# EAGLE schematic PowerBoard (EAGLE 9.6.2)
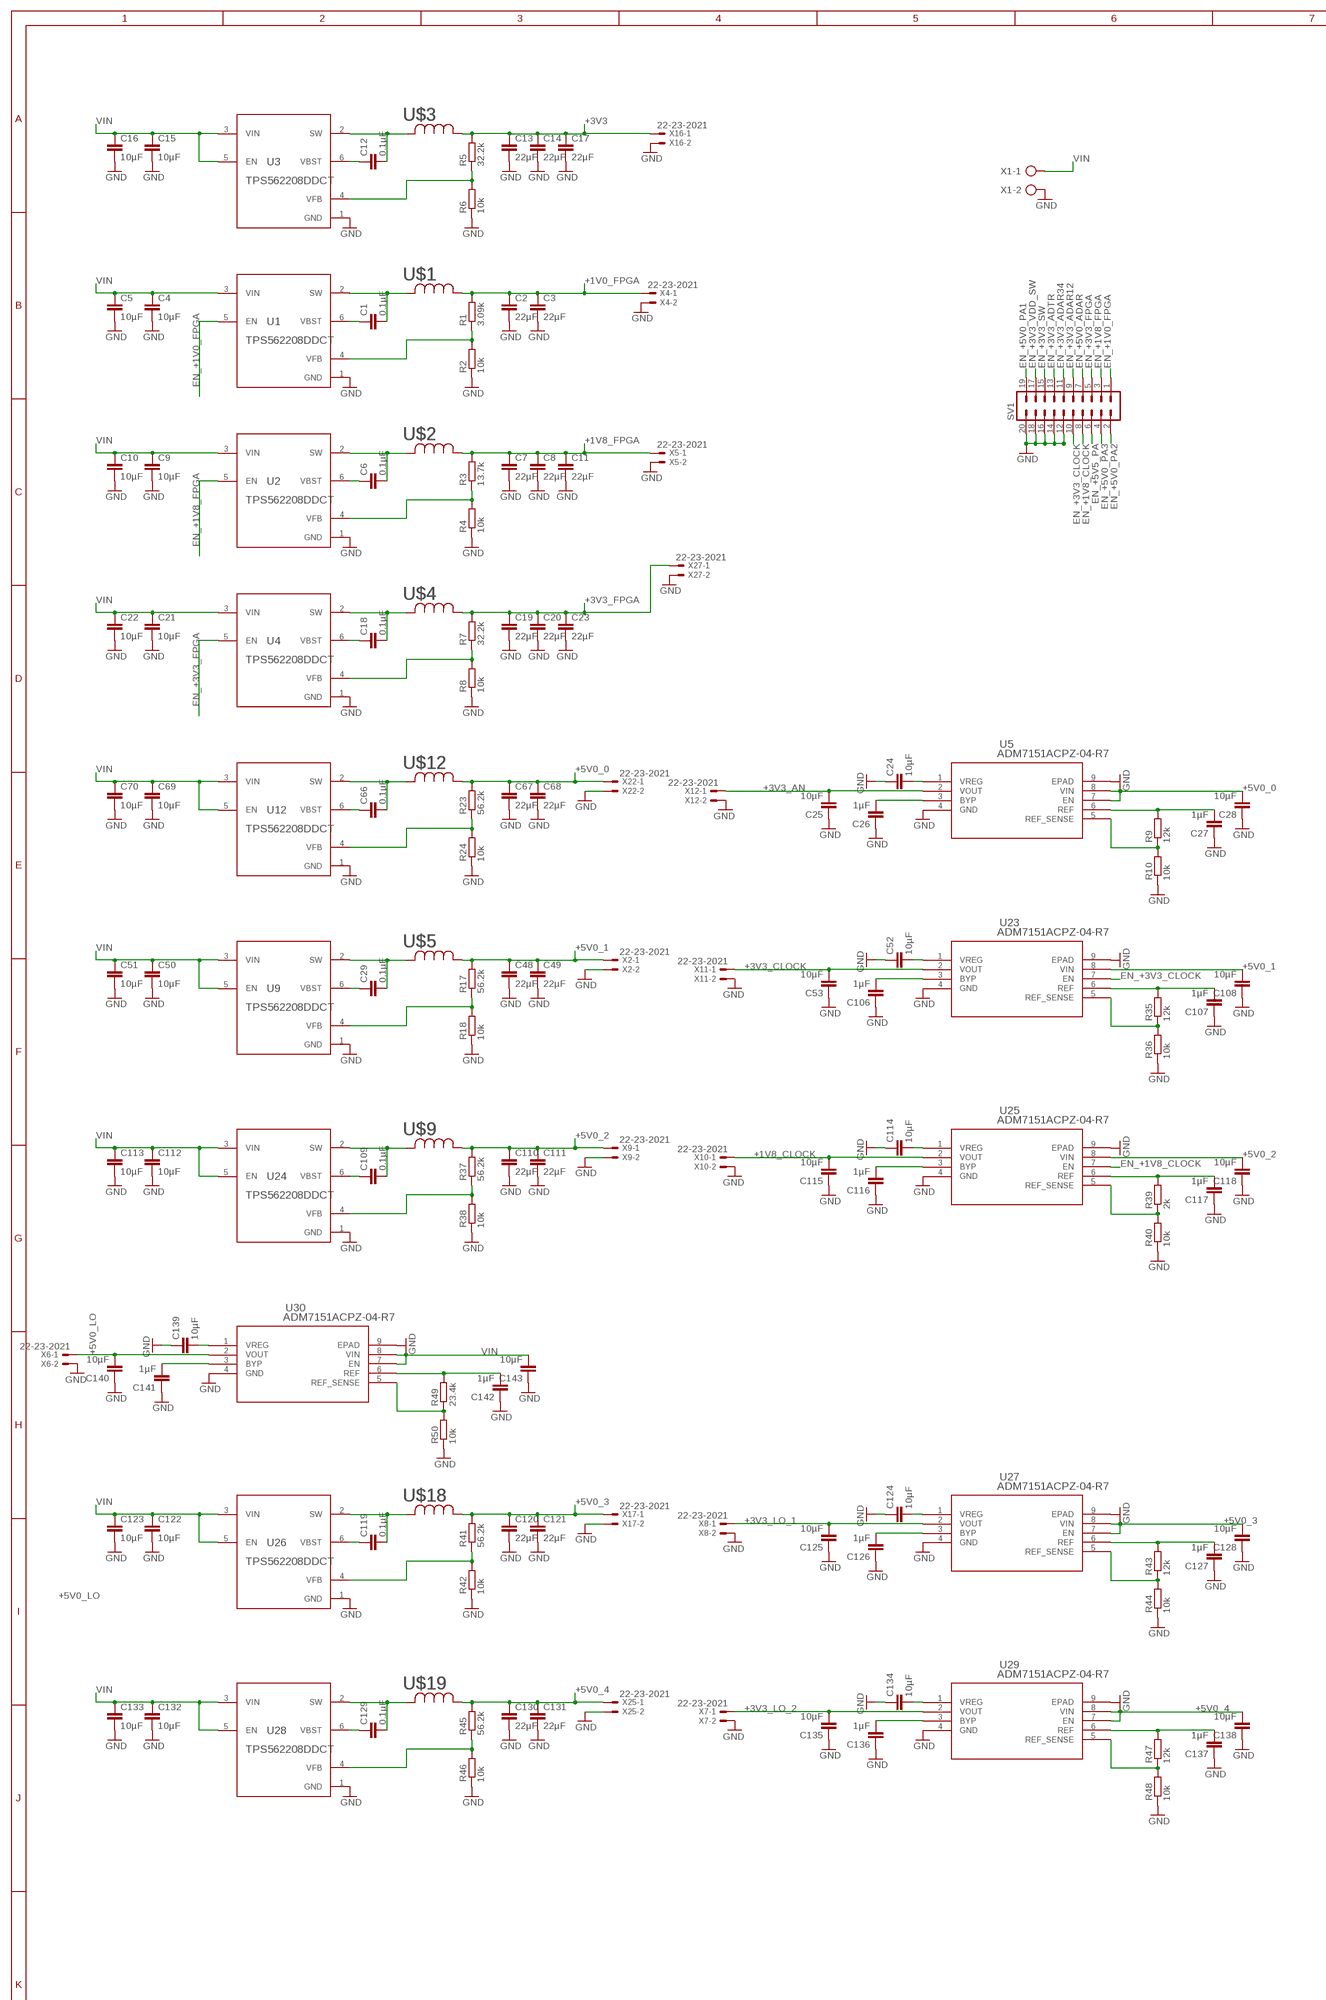
[diagram p0: schematic, sheet 1, part 1 of 3]
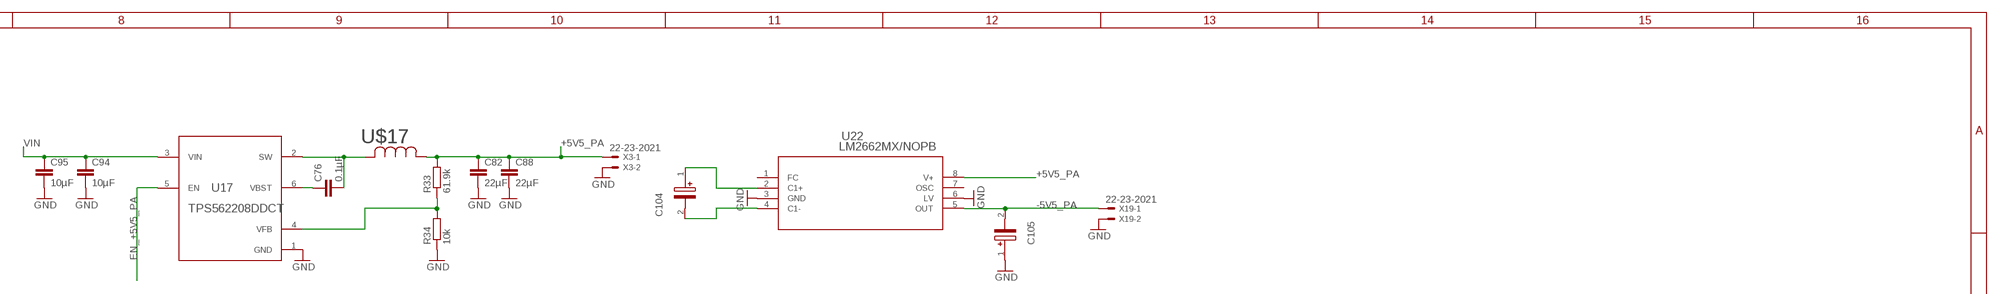
[diagram p1: schematic, sheet 1, part 2 of 3]
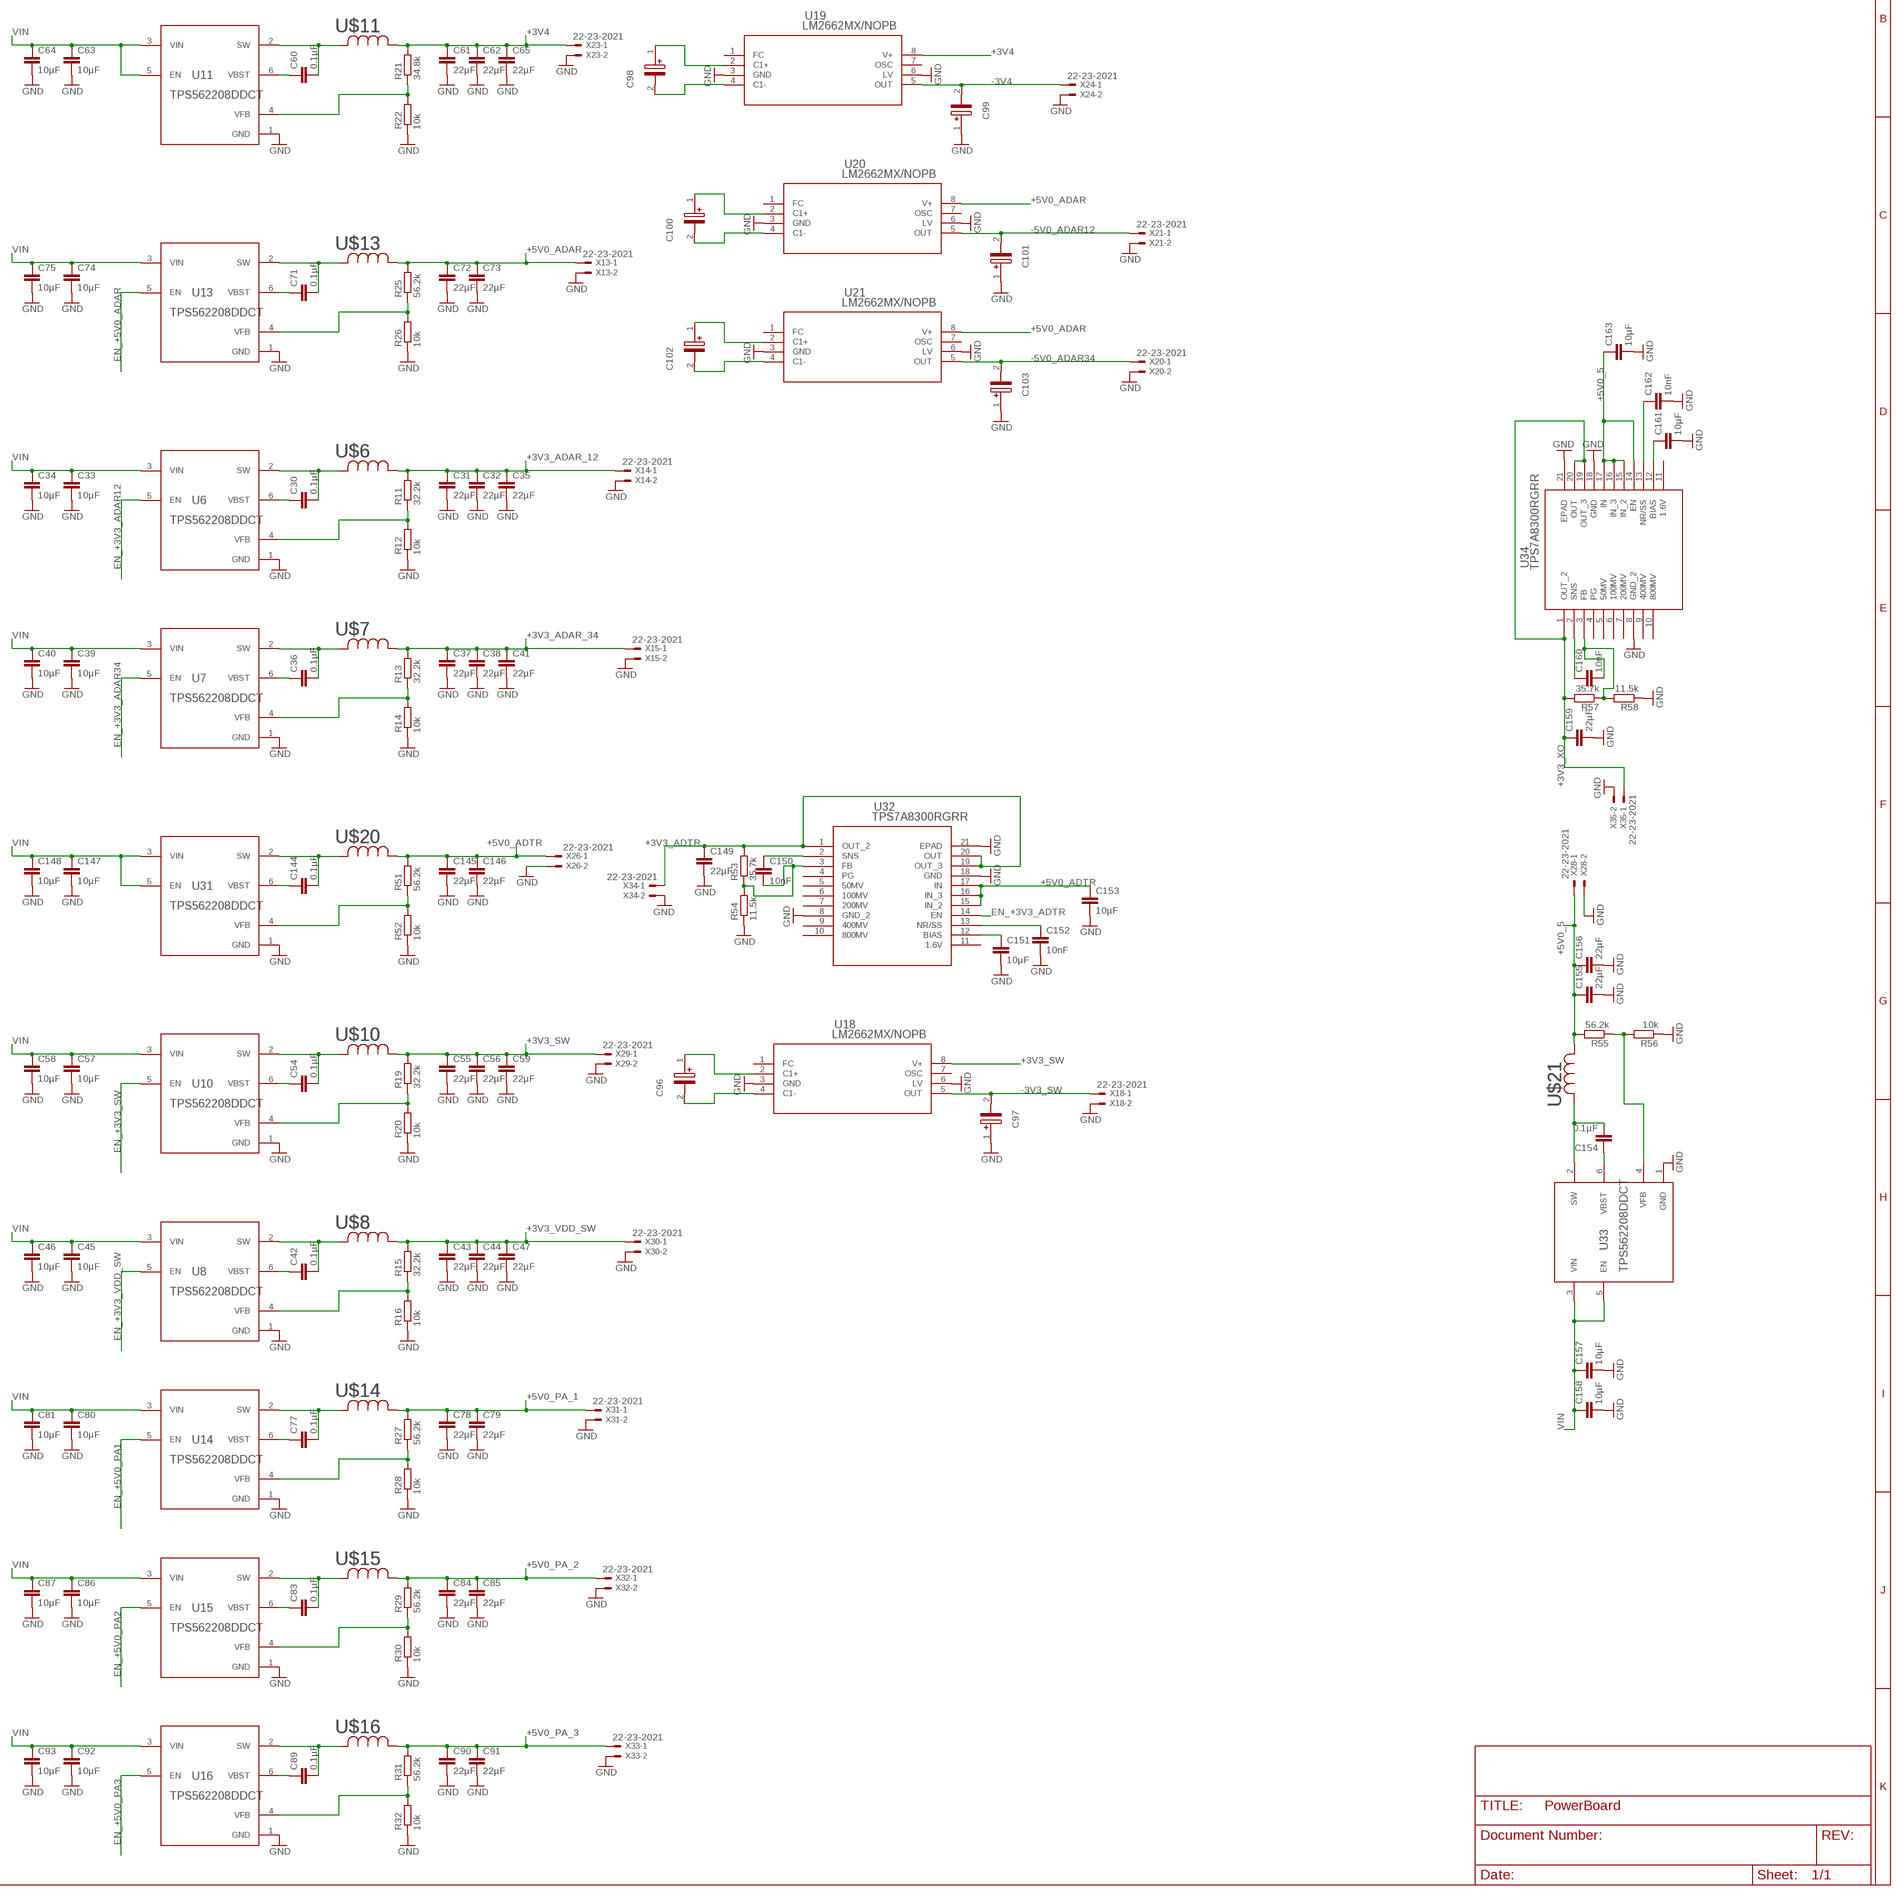
[diagram p2: schematic, sheet 1, part 3 of 3]

## Parts
C1  0.1µF  C-EUC0805  [C0805]
C2  22µF  C-EUC0603  [C0603]
C3  22µF  C-EUC0603  [C0603]
C4  10µF  C-EUC0805  [C0805]
C5  10µF  C-EUC0805  [C0805]
C6  0.1µF  C-EUC0805  [C0805]
C7  22µF  C-EUC0603  [C0603]
C8  22µF  C-EUC0603  [C0603]
C9  10µF  C-EUC0805  [C0805]
C10  10µF  C-EUC0805  [C0805]
C11  22µF  C-EUC0603  [C0603]
C12  0.1µF  C-EUC0805  [C0805]
C13  22µF  C-EUC0603  [C0603]
C14  22µF  C-EUC0603  [C0603]
C15  10µF  C-EUC0805  [C0805]
C16  10µF  C-EUC0805  [C0805]
C17  22µF  C-EUC0603  [C0603]
C18  0.1µF  C-EUC0805  [C0805]
C19  22µF  C-EUC0603  [C0603]
C20  22µF  C-EUC0603  [C0603]
C21  10µF  C-EUC0805  [C0805]
C22  10µF  C-EUC0805  [C0805]
C23  22µF  C-EUC0603  [C0603]
C24  10µF  C-EUC0805  [C0805]
C25  10µF  C-EUC0805  [C0805]
C26  1µF  C-EUC0805  [C0805]
C27  1µF  C-EUC0805  [C0805]
C28  10µF  C-EUC0805  [C0805]
C29  0.1µF  C-EUC0805  [C0805]
C30  0.1µF  C-EUC0805  [C0805]
C31  22µF  C-EUC0603  [C0603]
C32  22µF  C-EUC0603  [C0603]
C33  10µF  C-EUC0805  [C0805]
C34  10µF  C-EUC0805  [C0805]
C35  22µF  C-EUC0603  [C0603]
C36  0.1µF  C-EUC0805  [C0805]
C37  22µF  C-EUC0603  [C0603]
C38  22µF  C-EUC0603  [C0603]
C39  10µF  C-EUC0805  [C0805]
C40  10µF  C-EUC0805  [C0805]
C41  22µF  C-EUC0603  [C0603]
C42  0.1µF  C-EUC0805  [C0805]
C43  22µF  C-EUC0603  [C0603]
C44  22µF  C-EUC0603  [C0603]
C45  10µF  C-EUC0805  [C0805]
C46  10µF  C-EUC0805  [C0805]
C47  22µF  C-EUC0603  [C0603]
C48  22µF  C-EUC0603  [C0603]
C49  22µF  C-EUC0603  [C0603]
C50  10µF  C-EUC0805  [C0805]
C51  10µF  C-EUC0805  [C0805]
C52  10µF  C-EUC0805  [C0805]
C53  10µF  C-EUC0805  [C0805]
C54  0.1µF  C-EUC0805  [C0805]
C55  22µF  C-EUC0603  [C0603]
C56  22µF  C-EUC0603  [C0603]
C57  10µF  C-EUC0805  [C0805]
C58  10µF  C-EUC0805  [C0805]
C59  22µF  C-EUC0603  [C0603]
C60  0.1µF  C-EUC0805  [C0805]
C61  22µF  C-EUC0603  [C0603]
C62  22µF  C-EUC0603  [C0603]
C63  10µF  C-EUC0805  [C0805]
C64  10µF  C-EUC0805  [C0805]
C65  22µF  C-EUC0603  [C0603]
C66  0.1µF  C-EUC0805  [C0805]
C67  22µF  C-EUC0603  [C0603]
C68  22µF  C-EUC0603  [C0603]
C69  10µF  C-EUC0805  [C0805]
C70  10µF  C-EUC0805  [C0805]
C71  0.1µF  C-EUC0805  [C0805]
C72  22µF  C-EUC0603  [C0603]
C73  22µF  C-EUC0603  [C0603]
C74  10µF  C-EUC0805  [C0805]
C75  10µF  C-EUC0805  [C0805]
C76  0.1µF  C-EUC0805  [C0805]
C77  0.1µF  C-EUC0805  [C0805]
C78  22µF  C-EUC0603  [C0603]
C79  22µF  C-EUC0603  [C0603]
C80  10µF  C-EUC0805  [C0805]
C81  10µF  C-EUC0805  [C0805]
C82  22µF  C-EUC0603  [C0603]
C83  0.1µF  C-EUC0805  [C0805]
C84  22µF  C-EUC0603  [C0603]
C85  22µF  C-EUC0603  [C0603]
C86  10µF  C-EUC0805  [C0805]
C87  10µF  C-EUC0805  [C0805]
C88  22µF  C-EUC0603  [C0603]
C89  0.1µF  C-EUC0805  [C0805]
C90  22µF  C-EUC0603  [C0603]
C91  22µF  C-EUC0603  [C0603]
C92  10µF  C-EUC0805  [C0805]
C93  10µF  C-EUC0805  [C0805]
C94  10µF  C-EUC0805  [C0805]
C95  10µF  C-EUC0805  [C0805]
C96  T521W476M020ATE045  [T521W]
C97  T521W476M020ATE045  [T521W]
C98  T521W476M020ATE045  [T521W]
C99  T521W476M020ATE045  [T521W]
C100  T521W476M020ATE045  [T521W]
C101  T521W476M020ATE045  [T521W]
C102  T521W476M020ATE045  [T521W]
C103  T521W476M020ATE045  [T521W]
C104  T521W476M020ATE045  [T521W]
C105  T521W476M020ATE045  [T521W]
C106  1µF  C-EUC0805  [C0805]
C107  1µF  C-EUC0805  [C0805]
C108  10µF  C-EUC0805  [C0805]
C109  0.1µF  C-EUC0805  [C0805]
C110  22µF  C-EUC0603  [C0603]
C111  22µF  C-EUC0603  [C0603]
C112  10µF  C-EUC0805  [C0805]
C113  10µF  C-EUC0805  [C0805]
C114  10µF  C-EUC0805  [C0805]
C115  10µF  C-EUC0805  [C0805]
C116  1µF  C-EUC0805  [C0805]
C117  1µF  C-EUC0805  [C0805]
C118  10µF  C-EUC0805  [C0805]
C119  0.1µF  C-EUC0805  [C0805]
C120  22µF  C-EUC0603  [C0603]
C121  22µF  C-EUC0603  [C0603]
C122  10µF  C-EUC0805  [C0805]
C123  10µF  C-EUC0805  [C0805]
C124  10µF  C-EUC0805  [C0805]
C125  10µF  C-EUC0805  [C0805]
C126  1µF  C-EUC0805  [C0805]
C127  1µF  C-EUC0805  [C0805]
C128  10µF  C-EUC0805  [C0805]
C129  0.1µF  C-EUC0805  [C0805]
C130  22µF  C-EUC0603  [C0603]
C131  22µF  C-EUC0603  [C0603]
C132  10µF  C-EUC0805  [C0805]
C133  10µF  C-EUC0805  [C0805]
C134  10µF  C-EUC0805  [C0805]
C135  10µF  C-EUC0805  [C0805]
C136  1µF  C-EUC0805  [C0805]
C137  1µF  C-EUC0805  [C0805]
C138  10µF  C-EUC0805  [C0805]
C139  10µF  C-EUC0805  [C0805]
C140  10µF  C-EUC0805  [C0805]
C141  1µF  C-EUC0805  [C0805]
C142  1µF  C-EUC0805  [C0805]
C143  10µF  C-EUC0805  [C0805]
C144  0.1µF  C-EUC0805  [C0805]
C145  22µF  C-EUC0603  [C0603]
C146  22µF  C-EUC0603  [C0603]
C147  10µF  C-EUC0805  [C0805]
C148  10µF  C-EUC0805  [C0805]
C149  22µF  C-EUC0603  [C0603]
C150  10nF  C-EUC0603  [C0603]
C151  10µF  C-EUC0603  [C0603]
C152  10nF  C-EUC0603  [C0603]
C153  10µF  C-EUC0603  [C0603]
C154  0.1µF  C-EUC0805  [C0805]
C155  22µF  C-EUC0603  [C0603]
C156  22µF  C-EUC0603  [C0603]
C157  10µF  C-EUC0805  [C0805]
C158  10µF  C-EUC0805  [C0805]
C159  22µF  C-EUC0603  [C0603]
C160  10nF  C-EUC0603  [C0603]
C161  10µF  C-EUC0603  [C0603]
C162  10nF  C-EUC0603  [C0603]
C163  10µF  C-EUC0603  [C0603]
R1  3.09k  R-EU_M0805  [M0805]
R2  10k  R-EU_M0805  [M0805]
R3  13.7k  R-EU_M0805  [M0805]
R4  10k  R-EU_M0805  [M0805]
R5  32.2k  R-EU_M0805  [M0805]
R6  10k  R-EU_M0805  [M0805]
R7  32.2k  R-EU_M0805  [M0805]
R8  10k  R-EU_M0805  [M0805]
R9  12k  R-EU_M0805  [M0805]
R10  10k  R-EU_M0805  [M0805]
R11  32.2k  R-EU_M0805  [M0805]
R12  10k  R-EU_M0805  [M0805]
R13  32.2k  R-EU_M0805  [M0805]
R14  10k  R-EU_M0805  [M0805]
R15  32.2k  R-EU_M0805  [M0805]
R16  10k  R-EU_M0805  [M0805]
R17  56.2k  R-EU_M0805  [M0805]
R18  10k  R-EU_M0805  [M0805]
R19  32.2k  R-EU_M0805  [M0805]
R20  10k  R-EU_M0805  [M0805]
R21  34.8k  R-EU_M0805  [M0805]
R22  10k  R-EU_M0805  [M0805]
R23  56.2k  R-EU_M0805  [M0805]
R24  10k  R-EU_M0805  [M0805]
R25  56.2k  R-EU_M0805  [M0805]
R26  10k  R-EU_M0805  [M0805]
R27  56.2k  R-EU_M0805  [M0805]
R28  10k  R-EU_M0805  [M0805]
R29  56.2k  R-EU_M0805  [M0805]
R30  10k  R-EU_M0805  [M0805]
R31  56.2k  R-EU_M0805  [M0805]
R32  10k  R-EU_M0805  [M0805]
R33  61.9k  R-EU_M0805  [M0805]
R34  10k  R-EU_M0805  [M0805]
R35  12k  R-EU_M0805  [M0805]
R36  10k  R-EU_M0805  [M0805]
R37  56.2k  R-EU_M0805  [M0805]
R38  10k  R-EU_M0805  [M0805]
R39  2k  R-EU_M0805  [M0805]
R40  10k  R-EU_M0805  [M0805]
R41  56.2k  R-EU_M0805  [M0805]
R42  10k  R-EU_M0805  [M0805]
R43  12k  R-EU_M0805  [M0805]
R44  10k  R-EU_M0805  [M0805]
R45  56.2k  R-EU_M0805  [M0805]
R46  10k  R-EU_M0805  [M0805]
R47  12k  R-EU_M0805  [M0805]
R48  10k  R-EU_M0805  [M0805]
R49  23.4k  R-EU_M0805  [M0805]
R50  10k  R-EU_M0805  [M0805]
R51  56.2k  R-EU_M0805  [M0805]
R52  10k  R-EU_M0805  [M0805]
R53  35.7k  R-EU_M0805  [M0805]
R54  11.5k  R-EU_M0805  [M0805]
R55  56.2k  R-EU_M0805  [M0805]
R56  10k  R-EU_M0805  [M0805]
R57  35.7k  R-EU_M0805  [M0805]
R58  11.5k  R-EU_M0805  [M0805]
SV1  MA10-2  [MA10-2]
U1  TPS562208DDCT  [DDC0006A_N]
U2  TPS562208DDCT  [DDC0006A_N]
U3  TPS562208DDCT  [DDC0006A_N]
U4  TPS562208DDCT  [DDC0006A_N]
U5  ADM7151ACPZ-04-R7  [CP_8_11_ADI]
U6  TPS562208DDCT  [DDC0006A_N]
U7  TPS562208DDCT  [DDC0006A_N]
U8  TPS562208DDCT  [DDC0006A_N]
U9  TPS562208DDCT  [DDC0006A_N]
U10  TPS562208DDCT  [DDC0006A_N]
U11  TPS562208DDCT  [DDC0006A_N]
U12  TPS562208DDCT  [DDC0006A_N]
U13  TPS562208DDCT  [DDC0006A_N]
U14  TPS562208DDCT  [DDC0006A_N]
U15  TPS562208DDCT  [DDC0006A_N]
U16  TPS562208DDCT  [DDC0006A_N]
U17  TPS562208DDCT  [DDC0006A_N]
U18  LM2662MX/NOPB  [M08A]
U19  LM2662MX/NOPB  [M08A]
U20  LM2662MX/NOPB  [M08A]
U21  LM2662MX/NOPB  [M08A]
U22  LM2662MX/NOPB  [M08A]
U23  ADM7151ACPZ-04-R7  [CP_8_11_ADI]
U24  TPS562208DDCT  [DDC0006A_N]
U25  ADM7151ACPZ-04-R7  [CP_8_11_ADI]
U26  TPS562208DDCT  [DDC0006A_N]
U27  ADM7151ACPZ-04-R7  [CP_8_11_ADI]
U28  TPS562208DDCT  [DDC0006A_N]
U29  ADM7151ACPZ-04-R7  [CP_8_11_ADI]
U30  ADM7151ACPZ-04-R7  [CP_8_11_ADI]
U31  TPS562208DDCT  [DDC0006A_N]
U32  TPS7A8300RGRR  [RGR20_2P05X2P05_TEX]
U33  TPS562208DDCT  [DDC0006A_N]
U34  TPS7A8300RGRR  [RGR20_2P05X2P05_TEX]
U$1  2.2µH  POWER_INDUCTOR  [IND_VLP8040T-1R0N_TDK]
U$2  2.2µH  POWER_INDUCTOR  [IND_VLP8040T-1R0N_TDK]
U$3  3.3µH  POWER_INDUCTOR  [IND_VLP8040T-1R0N_TDK]
U$4  3.3µH  POWER_INDUCTOR  [IND_VLP8040T-1R0N_TDK]
U$5  3.3µH  POWER_INDUCTOR  [IND_VLP8040T-1R0N_TDK]
U$6  3.3µH  POWER_INDUCTOR  [IND_VLP8040T-1R0N_TDK]
U$7  3.3µH  POWER_INDUCTOR  [IND_VLP8040T-1R0N_TDK]
U$8  3.3µH  POWER_INDUCTOR  [IND_VLP8040T-1R0N_TDK]
U$9  3.3µH  POWER_INDUCTOR  [IND_VLP8040T-1R0N_TDK]
U$10  3.3µH  POWER_INDUCTOR  [IND_VLP8040T-1R0N_TDK]
U$11  3.3µH  POWER_INDUCTOR  [IND_VLP8040T-1R0N_TDK]
U$12  3.3µH  POWER_INDUCTOR  [IND_VLP8040T-1R0N_TDK]
U$13  3.3µH  POWER_INDUCTOR  [IND_VLP8040T-1R0N_TDK]
U$14  3.3µH  POWER_INDUCTOR  [IND_VLP8040T-1R0N_TDK]
U$15  3.3µH  POWER_INDUCTOR  [IND_VLP8040T-1R0N_TDK]
U$16  3.3µH  POWER_INDUCTOR  [IND_VLP8040T-1R0N_TDK]
U$17  3.3µH  POWER_INDUCTOR  [IND_VLP8040T-1R0N_TDK]
U$18  3.3µH  POWER_INDUCTOR  [IND_VLP8040T-1R0N_TDK]
U$19  3.3µH  POWER_INDUCTOR  [IND_VLP8040T-1R0N_TDK]
U$20  3.3µH  POWER_INDUCTOR  [IND_VLP8040T-1R0N_TDK]
U$21  3.3µH  POWER_INDUCTOR  [IND_VLP8040T-1R0N_TDK]
X1  AK300/2  [AK300/2]
X2  22-23-2021  [22-23-2021]
X3  22-23-2021  [22-23-2021]
X4  22-23-2021  [22-23-2021]
X5  22-23-2021  [22-23-2021]
X6  22-23-2021  [22-23-2021]
X7  22-23-2021  [22-23-2021]
X8  22-23-2021  [22-23-2021]
X9  22-23-2021  [22-23-2021]
X10  22-23-2021  [22-23-2021]
X11  22-23-2021  [22-23-2021]
X12  22-23-2021  [22-23-2021]
X13  22-23-2021  [22-23-2021]
X14  22-23-2021  [22-23-2021]
X15  22-23-2021  [22-23-2021]
X16  22-23-2021  [22-23-2021]
X17  22-23-2021  [22-23-2021]
X18  22-23-2021  [22-23-2021]
X19  22-23-2021  [22-23-2021]
X20  22-23-2021  [22-23-2021]
X21  22-23-2021  [22-23-2021]
X22  22-23-2021  [22-23-2021]
X23  22-23-2021  [22-23-2021]
X24  22-23-2021  [22-23-2021]
X25  22-23-2021  [22-23-2021]
X26  22-23-2021  [22-23-2021]
X27  22-23-2021  [22-23-2021]
X28  22-23-2021  [22-23-2021]
X29  22-23-2021  [22-23-2021]
X30  22-23-2021  [22-23-2021]
X31  22-23-2021  [22-23-2021]
X32  22-23-2021  [22-23-2021]
X33  22-23-2021  [22-23-2021]
X34  22-23-2021  [22-23-2021]
X35  22-23-2021  [22-23-2021]

## Nets
+1V0_FPGA: C2.1 C3.1 R1.2 U$1.1 X4.1
+1V8_CLOCK: C115.2 U25.2(VOUT) X10.1
+1V8_FPGA: C7.1 C8.1 C11.1 R3.2 U$2.1 X5.1
+3V3: C13.1 C14.1 C17.1 R5.2 U$3.1 X16.1
+3V3_ADAR_12: C31.1 C32.1 C35.1 R11.2 U$6.1 X14.1
+3V3_ADAR_34: C37.1 C38.1 C41.1 R13.2 U$7.1 X15.1
+3V3_ADTR: C149.1 R53.2 U32.1(OUT_2) U32.19(OUT_3) U32.20(OUT) X34.1
+3V3_AN: C25.2 U5.2(VOUT) X12.1
+3V3_CLOCK: C53.2 U23.2(VOUT) X11.1
+3V3_FPGA: C19.1 C20.1 C23.1 R7.2 U$4.1 X27.1
+3V3_LO_1: C125.2 U27.2(VOUT) X8.1
+3V3_LO_2: C135.2 U29.2(VOUT) X7.1
+3V3_SW: C55.1 C56.1 C59.1 R19.2 U18.8(V+) U$10.1 X29.1
+3V3_VDD_SW: C43.1 C44.1 C47.1 R15.2 U$8.1 X30.1
+3V3_XO: C159.1 R57.2 U34.1(OUT_2) U34.19(OUT_3) U34.20(OUT) X35.1
+3V4: C61.1 C62.1 C65.1 R21.2 U19.8(V+) U$11.1 X23.1
+5V0_0: C28.2 C67.1 C68.1 R23.2 U5.7(EN) U5.8(VIN) U$12.1 X22.1
+5V0_1: C48.1 C49.1 C108.2 R17.2 U23.8(VIN) U$5.1 X2.1
+5V0_2: C110.1 C111.1 C118.2 R37.2 U25.8(VIN) U$9.1 X9.1
+5V0_3: C120.1 C121.1 C128.2 R41.2 U27.7(EN) U27.8(VIN) U$18.1 X17.1
+5V0_4: C130.1 C131.1 C138.2 R45.2 U29.7(EN) U29.8(VIN) U$19.1 X25.1
+5V0_5: C155.1 C156.1 C163.1 R55.2 U34.14(EN) U34.15(IN_2) U34.16(IN_3) U34.17(IN) U$21.1 X28.1
+5V0_ADAR: C72.1 C73.1 R25.2 U20.8(V+) U21.8(V+) U$13.1 X13.1
+5V0_ADTR: C145.1 C146.1 C153.1 R51.2 U32.15(IN_2) U32.16(IN_3) U32.17(IN) U$20.1 X26.1
+5V0_LO: C140.2 U30.2(VOUT) X6.1
+5V0_PA_1: C78.1 C79.1 R27.2 U$14.1 X31.1
+5V0_PA_2: C84.1 C85.1 R29.2 U$15.1 X32.1
+5V0_PA_3: C90.1 C91.1 R31.2 U$16.1 X33.1
+5V5_PA: C82.1 C88.1 R33.2 U22.8(V+) U$17.1 X3.1
-3V3_SW: C97.2(-) U18.5(OUT) X18.1
-3V4: C99.2(-) U19.5(OUT) X24.1
-5V0_ADAR12: C101.2(-) U20.5(OUT) X21.1
-5V0_ADAR34: C103.2(-) U21.5(OUT) X20.1
-5V5_PA: C105.2(-) U22.5(OUT) X19.1
EN_+1V0_FPGA: SV1.1 U1.5(EN)
EN_+1V8_CLOCK: SV1.8 U25.7(EN)
EN_+1V8_FPGA: SV1.3 U2.5(EN)
EN_+3V3_ADAR12: SV1.9 U6.5(EN)
EN_+3V3_ADAR34: SV1.11 U7.5(EN)
EN_+3V3_ADTR: SV1.13 U32.14(EN)
EN_+3V3_CLOCK: SV1.10 U23.7(EN)
EN_+3V3_FPGA: SV1.5 U4.5(EN)
EN_+3V3_SW: SV1.15 U10.5(EN)
EN_+3V3_VDD_SW: SV1.17 U8.5(EN)
EN_+5V0_ADAR: SV1.7 U13.5(EN)
EN_+5V0_PA1: SV1.19 U14.5(EN)
EN_+5V0_PA2: SV1.2 U15.5(EN)
EN_+5V0_PA3: SV1.4 U16.5(EN)
EN_+5V5_PA: SV1.6 U17.5(EN)
GND: C2.2 C3.2 C4.2 C5.2 C7.2 C8.2 C9.2 C10.2 C11.2 C13.2 C14.2 C15.2 C16.2 C17.2 C19.2 C20.2 C21.2 C22.2 C23.2 C24.1 C25.1 C26.1 C27.1 C28.1 C31.2 C32.2 C33.2 C34.2 C35.2 C37.2 C38.2 C39.2 C40.2 C41.2 C43.2 C44.2 C45.2 C46.2 C47.2 C48.2 C49.2 C50.2 C51.2 C52.1 C53.1 C55.2 C56.2 C57.2 C58.2 C59.2 C61.2 C62.2 C63.2 C64.2 C65.2 C67.2 C68.2 C69.2 C70.2 C72.2 C73.2 C74.2 C75.2 C78.2 C79.2 C80.2 C81.2 C82.2 C84.2 C85.2 C86.2 C87.2 C88.2 C90.2 C91.2 C92.2 C93.2 C94.2 C95.2 C97.1(+) C99.1(+) C101.1(+) C103.1(+) C105.1(+) C106.1 C107.1 C108.1 C110.2 C111.2 C112.2 C113.2 C114.1 C115.1 C116.1 C117.1 C118.1 C120.2 C121.2 C122.2 C123.2 C124.1 C125.1 C126.1 C127.1 C128.1 C130.2 C131.2 C132.2 C133.2 C134.1 C135.1 C136.1 C137.1 C138.1 C139.1 C140.1 C141.1 C142.1 C143.1 C145.2 C146.2 C147.2 C148.2 C149.2 C151.2 C152.2 C153.2 C155.2 C156.2 C157.2 C158.2 C159.2 C161.2 C162.2 C163.2 R2.1 R4.1 R6.1 R8.1 R10.1 R12.1 R14.1 R16.1 R18.1 R20.1 R22.1 R24.1 R26.1 R28.1 R30.1 R32.1 R34.1 R36.1 R38.1 R40.1 R42.1 R44.1 R46.1 R48.1 R50.1 R52.1 R54.1 R56.1 R58.1 SV1.12 SV1.14 SV1.16 SV1.18 SV1.20 U1.1(GND) U2.1(GND) U3.1(GND) U4.1(GND) U5.4(GND) U5.9(EPAD) U6.1(GND) U7.1(GND) U8.1(GND) U9.1(GND) U10.1(GND) U11.1(GND) U12.1(GND) U13.1(GND) U14.1(GND) U15.1(GND) U16.1(GND) U17.1(GND) U18.3(GND) U18.6(LV) U19.3(GND) U19.6(LV) U20.3(GND) U20.6(LV) U21.3(GND) U21.6(LV) U22.3(GND) U22.6(LV) U23.4(GND) U23.9(EPAD) U24.1(GND) U25.4(GND) U25.9(EPAD) U26.1(GND) U27.4(GND) U27.9(EPAD) U28.1(GND) U29.4(GND) U29.9(EPAD) U30.4(GND) U30.9(EPAD) U31.1(GND) U32.8(GND_2) U32.18(GND) U32.21(EPAD) U33.1(GND) U34.8(GND_2) U34.18(GND) U34.21(EPAD) X1.2 X2.2 X3.2 X4.2 X5.2 X6.2 X7.2 X8.2 X9.2 X10.2 X11.2 X12.2 X13.2 X14.2 X15.2 X16.2 X17.2 X18.2 X19.2 X20.2 X21.2 X22.2 X23.2 X24.2 X25.2 X26.2 X27.2 X28.2 X29.2 X30.2 X31.2 X32.2 X33.2 X34.2 X35.2
N$1: C1.2 U1.2(SW) U$1.2
N$2: C1.1 U1.6(VBST)
N$3: C6.2 U2.2(SW) U$2.2
N$4: R1.1 R2.2 U1.4(VFB)
N$5: C6.1 U2.6(VBST)
N$6: R3.1 R4.2 U2.4(VFB)
N$7: C12.2 U3.2(SW) U$3.2
N$8: C12.1 U3.6(VBST)
N$9: R5.1 R6.2 U3.4(VFB)
N$10: C18.2 U4.2(SW) U$4.2
N$11: C18.1 U4.6(VBST)
N$12: R7.1 R8.2 U4.4(VFB)
N$13: C24.2 U5.1(VREG)
N$14: C139.2 U30.1(VREG)
N$15: C26.2 U5.3(BYP)
N$16: C30.2 U6.2(SW) U$6.2
N$17: C30.1 U6.6(VBST)
N$18: R11.1 R12.2 U6.4(VFB)
N$19: C36.2 U7.2(SW) U$7.2
N$20: C36.1 U7.6(VBST)
N$21: R13.1 R14.2 U7.4(VFB)
N$22: C42.2 U8.2(SW) U$8.2
N$23: C42.1 U8.6(VBST)
N$24: R15.1 R16.2 U8.4(VFB)
N$25: R9.1 R10.2 U5.5(REF_SENSE)
N$26: C29.2 U9.2(SW) U$5.2
N$27: C27.2 R9.2 U5.6(REF)
N$28: C54.2 U10.2(SW) U$10.2
N$29: C54.1 U10.6(VBST)
N$30: R19.1 R20.2 U10.4(VFB)
N$31: C60.2 U11.2(SW) U$11.2
N$32: C60.1 U11.6(VBST)
N$33: R21.1 R22.2 U11.4(VFB)
N$34: C66.2 U12.2(SW) U$12.2
N$35: C66.1 U12.6(VBST)
N$36: R23.1 R24.2 U12.4(VFB)
N$37: C71.2 U13.2(SW) U$13.2
N$38: C71.1 U13.6(VBST)
N$39: R25.1 R26.2 U13.4(VFB)
N$40: C77.2 U14.2(SW) U$14.2
N$41: C77.1 U14.6(VBST)
N$42: R27.1 R28.2 U14.4(VFB)
N$43: C83.2 U15.2(SW) U$15.2
N$44: C83.1 U15.6(VBST)
N$45: R29.1 R30.2 U15.4(VFB)
N$46: C89.2 U16.2(SW) U$16.2
N$47: C89.1 U16.6(VBST)
N$48: R31.1 R32.2 U16.4(VFB)
N$49: C76.2 U17.2(SW) U$17.2
N$50: C76.1 U17.6(VBST)
N$51: R33.1 R34.2 U17.4(VFB)
N$52: C98.1(+) U19.2(C1+)
N$53: C98.2(-) U19.4(C1-)
N$54: C96.1(+) U18.2(C1+)
N$55: C96.2(-) U18.4(C1-)
N$56: C100.1(+) U20.2(C1+)
N$57: C100.2(-) U20.4(C1-)
N$58: C102.1(+) U21.2(C1+)
N$59: C102.2(-) U21.4(C1-)
N$60: C104.1(+) U22.2(C1+)
N$61: C104.2(-) U22.4(C1-)
N$62: C141.2 U30.3(BYP)
N$63: R49.1 R50.2 U30.5(REF_SENSE)
N$64: C29.1 U9.6(VBST)
N$65: R17.1 R18.2 U9.4(VFB)
N$66: C52.2 U23.1(VREG)
N$67: C142.2 R49.2 U30.6(REF)
N$68: C106.2 U23.3(BYP)
N$69: R35.1 R36.2 U23.5(REF_SENSE)
N$70: C107.2 R35.2 U23.6(REF)
N$71: C144.2 U31.2(SW) U$20.2
N$72: C144.1 U31.6(VBST)
N$73: C109.2 U24.2(SW) U$9.2
N$74: C109.1 U24.6(VBST)
N$75: R37.1 R38.2 U24.4(VFB)
N$76: C114.2 U25.1(VREG)
N$77: R51.1 R52.2 U31.4(VFB)
N$78: C116.2 U25.3(BYP)
N$79: R39.1 R40.2 U25.5(REF_SENSE)
N$80: C117.2 R39.2 U25.6(REF)
N$81: C154.2 U33.2(SW) U$21.2
N$82: C150.1 U32.2(SNS)
N$83: C119.2 U26.2(SW) U$18.2
N$84: C119.1 U26.6(VBST)
N$85: R41.1 R42.2 U26.4(VFB)
N$86: C124.2 U27.1(VREG)
N$87: C154.1 U33.6(VBST)
N$88: C126.2 U27.3(BYP)
N$89: R43.1 R44.2 U27.5(REF_SENSE)
N$90: C127.2 R43.2 U27.6(REF)
N$91: C150.2 R53.1 R54.2 U32.3(FB)
N$92: C151.1 U32.12(BIAS)
N$93: C129.2 U28.2(SW) U$19.2
N$94: C129.1 U28.6(VBST)
N$95: R45.1 R46.2 U28.4(VFB)
N$96: C134.2 U29.1(VREG)
N$97: R55.1 R56.2 U33.4(VFB)
N$98: C136.2 U29.3(BYP)
N$99: R47.1 R48.2 U29.5(REF_SENSE)
N$100: C137.2 R47.2 U29.6(REF)
N$101: C152.1 U32.13(NR/SS)
N$102: C160.1 U34.2(SNS)
N$103: C160.2 R57.1 R58.2 U34.3(FB)
N$104: C161.1 U34.12(BIAS)
N$105: C162.1 U34.13(NR/SS)
VIN: C4.1 C5.1 C9.1 C10.1 C15.1 C16.1 C21.1 C22.1 C33.1 C34.1 C39.1 C40.1 C45.1 C46.1 C50.1 C51.1 C57.1 C58.1 C63.1 C64.1 C69.1 C70.1 C74.1 C75.1 C80.1 C81.1 C86.1 C87.1 C92.1 C93.1 C94.1 C95.1 C112.1 C113.1 C122.1 C123.1 C132.1 C133.1 C143.2 C147.1 C148.1 C157.1 C158.1 U1.3(VIN) U2.3(VIN) U3.3(VIN) U3.5(EN) U4.3(VIN) U6.3(VIN) U7.3(VIN) U8.3(VIN) U9.3(VIN) U9.5(EN) U10.3(VIN) U11.3(VIN) U11.5(EN) U12.3(VIN) U12.5(EN) U13.3(VIN) U14.3(VIN) U15.3(VIN) U16.3(VIN) U17.3(VIN) U24.3(VIN) U24.5(EN) U26.3(VIN) U26.5(EN) U28.3(VIN) U28.5(EN) U30.7(EN) U30.8(VIN) U31.3(VIN) U31.5(EN) U33.3(VIN) U33.5(EN) X1.1
Unconnected: U18.1(FC) U18.7(OSC) U19.1(FC) U19.7(OSC) U20.1(FC) U20.7(OSC) U21.1(FC) U21.7(OSC) U22.1(FC) U22.7(OSC) U32.4(PG) U32.5(50MV) U32.6(100MV) U32.7(200MV) U32.9(400MV) U32.10(800MV) U32.11(1.6V) U34.4(PG) U34.5(50MV) U34.6(100MV) U34.7(200MV) U34.9(400MV) U34.10(800MV) U34.11(1.6V)

## Library data of the parts
C1-C95 C106-C163 = rcl:C-EU: CAPACITOR, European symbol; SPICEPREFIX: C
C96-C105 = T521W476M020ATE045:T521W476M020ATE045: T521, Tantalum, Polymer Tantalum, Commercial Grade, 47 uF, 20%, 20 VDC, 105C, -55C, 105C, SMD, Polymer, Molded, Low Profile/ESR, NonCombustible, 2,000 Hrs, 9 % , 45 mOhms, 94 uA, 222.95 mg, 7343, 1.4mm, Height Max = 1.5mm, 1000, 52 Weeks Source: Datasheet <https://content.kemet.com/datasheets/KEM_T2076_T52X-530.pdf>; DESCRIPTION: T521, Tantalum, Polymer Tantalum, Commercial Grade, 47 uF, 20%, 20 VDC, 105C, -55C, 105C, SMD, Polymer, Molded, Low Profile/ESR, NonCombustible, 2,000 Hrs, 9 % , 45 mOhms, 94 uA, 222.95 mg, 7343, 1.4mm, Height Max = 1.5mm, 1000, 52 Weeks; HEIGHT: 1.5mm; MANUFACTURER_NAME: KEMET; MANUFACTURER_PART_NUMBER: T521W476M020ATE045; MOUSER_PART_NUMBER: 80-T521W476M20ATE045; MOUSER_PRICE-STOCK: https://www.mouser.co.uk/ProductDetail/KEMET/T521W476M020ATE045?qs=Ad%252Bh9aq9FyVtchBw1jwoFA%3D%3D
R1-R58 = rcl:R-EU_: RESISTOR, European symbol; SPICEPREFIX: R
SV1 = con-lstb:MA10-2: PIN HEADER; OC_FARNELL: unknown; OC_NEWARK: unknown
U1-U4 U6-U17 U24 U26 U28 U31 U33 = My_Library_RADAR:TPS562208DDCT; COPYRIGHT: Copyright (C) 2025 Ultra Librarian. All rights reserved.; DATASHEET: https://www.ti.com/lit/gpn/tps562208; DESCRIPTION: 4.5 V to 17 V input, 2 A output, synchronous step-down converter in FCCM mode 6-SOT-23-THIN -40 to 125; MANUFACTURER_NAME: Texas Instruments; MANUFACTURER_PART_NUMBER: TPS562208DDCT; REFDES: RefDes; TYPE: TYPE
U5 U23 U25 U27 U29 U30 = My_Library_RADAR:ADM7151ACPZ-04-R7; COPYRIGHT: Copyright (C) 2025 Ultra Librarian. All rights reserved.; DATASHEET: https://www.analog.com/media/en/technical-documentation/data-sheets/ADM7151.pdf; DESCRIPTION: 800 mA Ultralow Noise, High PSRR, RF Linear Regulator; MANUFACTURER_NAME: Analog Devices Inc; MANUFACTURER_PART_NUMBER: ADM7151ACPZ-04-R7
U18-U22 = My_Library:LM2662MX/NOPB; COPYRIGHT: Copyright (C) 2024 Ultra Librarian. All rights reserved.; MANUFACTURER_PART_NUMBER: LM2662MX/NOPB; MFR_NAME: Texas Instruments; TYPE: LM2662M
U32 U34 = My_Library_RADAR:TPS7A8300RGRR; COPYRIGHT: Copyright (C) 2025 Ultra Librarian. All rights reserved.; DATASHEET: https://www.ti.com/lit/gpn/tps7a8300; DESCRIPTION: 2-A, low-VIN, low-2-A, low-VIN, low-noise, ultra-low-dropout voltage regulator with power good wi 20-VQFN -40 to 125; MANUFACTURER_NAME: Texas Instruments; MANUFACTURER_PART_NUMBER: TPS7A8300RGRR
U$1-U$21 = My_Library_RADAR:POWER_INDUCTOR
X1 = con-ptr500:AK300/2: CONNECTOR; OC_FARNELL: unknown; OC_NEWARK: unknown
X2-X35 = con-molex:22-23-2021: .100" (2.54mm) Center Header - 2 Pin; MF: MOLEX; MPN: 22-23-2021; OC_FARNELL: 1462926; OC_NEWARK: 25C3832